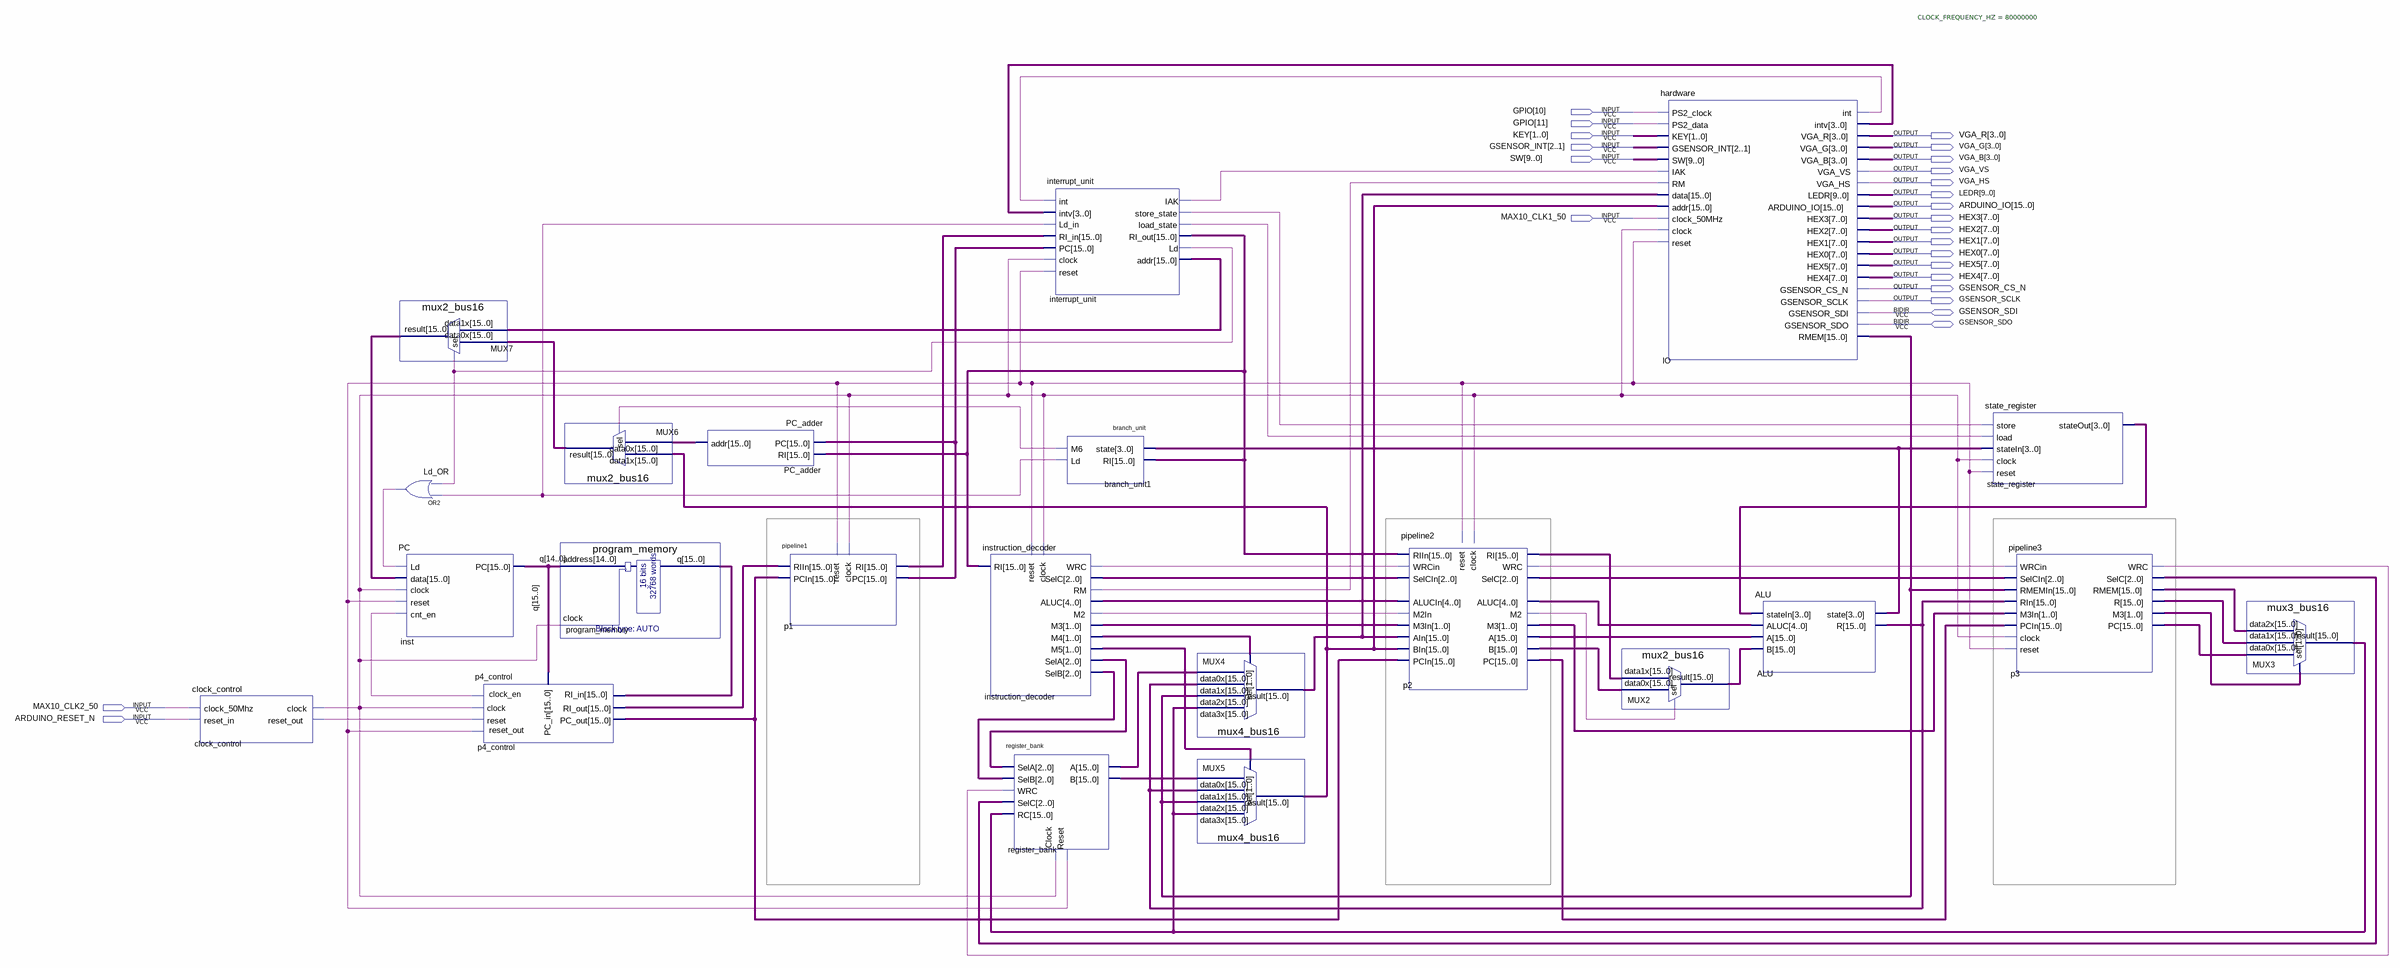
[diagram p0: schematic sheet]
// Quartus schematic P4.bdf as structural Verilog: 22 symbols, 25 pins
module P4 (
  input  [11:10] GPIO,
  input  [1:0] KEY,
  input  [2:1] GSENSOR_INT,
  input  [9:0] SW,
  input  MAX10_CLK1_50,
  input  MAX10_CLK2_50,
  input  ARDUINO_RESET_N,
  inout  GSENSOR_SDI,
  inout  GSENSOR_SDO,
  output [3:0] VGA_R,
  output [3:0] VGA_G,
  output [3:0] VGA_B,
  output VGA_VS,
  output VGA_HS,
  output [9:0] LEDR,
  output [15:0] ARDUINO_IO,
  output [7:0] HEX3,
  output [7:0] HEX2,
  output [7:0] HEX1,
  output [7:0] HEX0,
  output [7:0] HEX5,
  output [7:0] HEX4,
  output GSENSOR_CS_N,
  output GSENSOR_SCLK
);

  wire branch_unit1_ld, branch_unit1_m6, clock_control_clock, clock_control_reset_out,
       instruction_decoder_m2, instruction_decoder_rm, instruction_decoder_wrc, interrupt_unit_iak,
       interrupt_unit_ld, interrupt_unit_load_state, interrupt_unit_store_state, IO_int, Ld_OR_out, p2_m2,
       p2_wrc, p3_wrc, p4_control_clock_en, p4_control_reset_out;
  wire [1:0] instruction_decoder_m3, instruction_decoder_m4, instruction_decoder_m5, p2_m3, p3_m3;
  wire [2:0] instruction_decoder_sela, instruction_decoder_selb, instruction_decoder_selc, p2_selc, p3_selc;
  wire [3:0] ALU_state, IO_intv, state_register_stateout;
  wire [4:0] instruction_decoder_aluc, p2_aluc;
  wire [15:0] ALU_r, interrupt_unit_addr, interrupt_unit_ri_out, IO_rmem, MUX2_result, MUX3_result,
       MUX4_result, MUX5_result, MUX6_result, MUX7_result, p1_pc, p1_ri, p2_a, p2_b, p2_pc, p2_ri, p3_pc,
       p3_r, p3_rmem, p4_control_pc_out, p4_control_ri_out, PC_adder_addr, program_memory_q, q,
       register_bank_a, register_bank_b;

  clock_control clock_control (
    .clock_50Mhz(MAX10_CLK2_50), .reset_in(ARDUINO_RESET_N), .clock(clock_control_clock),
    .reset_out(clock_control_reset_out));
  mux2_bus16 MUX7 (.data1x(interrupt_unit_addr), .data0x(MUX6_result), .sel(interrupt_unit_ld), .result(MUX7_result));
  or Ld_OR (Ld_OR_out, branch_unit1_ld, interrupt_unit_ld);
  PC inst (
    .Ld(Ld_OR_out), .data(MUX7_result), .clock(clock_control_clock), .reset(p4_control_reset_out),
    .cnt_en(p4_control_clock_en), .PC(q));
  p4_control p4_control (
    .PC_in(q), .RI_in(program_memory_q), .clock(clock_control_clock), .reset(clock_control_reset_out),
    .clock_en(p4_control_clock_en), .reset_out(p4_control_reset_out), .PC_out(p4_control_pc_out),
    .RI_out(p4_control_ri_out));
  mux2_bus16 MUX6 (.data1x(MUX5_result), .data0x(PC_adder_addr), .sel(branch_unit1_m6), .result(MUX6_result));
  program_memory program_memory (.address(q[14:0]), .clock(clock_control_clock), .q(program_memory_q));
  PC_adder PC_adder (.PC(p1_pc), .RI(interrupt_unit_ri_out), .addr(PC_adder_addr));
  pipeline1 p1 (
    .RIIn(p4_control_ri_out), .PCIn(p4_control_pc_out), .clock(clock_control_clock),
    .reset(p4_control_reset_out), .RI(p1_ri), .PC(p1_pc));
  instruction_decoder instruction_decoder (
    .RI(interrupt_unit_ri_out), .clock(clock_control_clock), .reset(p4_control_reset_out),
    .WRC(instruction_decoder_wrc), .SelC(instruction_decoder_selc), .RM(instruction_decoder_rm),
    .ALUC(instruction_decoder_aluc), .M2(instruction_decoder_m2), .M3(instruction_decoder_m3),
    .M4(instruction_decoder_m4), .M5(instruction_decoder_m5), .SelA(instruction_decoder_sela),
    .SelB(instruction_decoder_selb));
  register_bank register_bank (
    .SelA(instruction_decoder_sela), .SelB(instruction_decoder_selb), .WRC(p3_wrc), .SelC(p3_selc),
    .RC(MUX3_result), .Reset(p4_control_reset_out), .Clock(clock_control_clock), .A(register_bank_a),
    .B(register_bank_b));
  interrupt_unit interrupt_unit (
    .\int (IO_int), .intv(IO_intv), .Ld_in(branch_unit1_ld), .RI_in(p1_ri), .PC(p1_pc),
    .clock(clock_control_clock), .reset(p4_control_reset_out), .IAK(interrupt_unit_iak),
    .store_state(interrupt_unit_store_state), .load_state(interrupt_unit_load_state),
    .RI_out(interrupt_unit_ri_out), .Ld(interrupt_unit_ld), .addr(interrupt_unit_addr));
  branch_unit branch_unit1 (.state(ALU_state), .RI(interrupt_unit_ri_out), .M6(branch_unit1_m6), .Ld(branch_unit1_ld));
  mux4_bus16 MUX4 (
    .data3x(MUX3_result), .data2x(IO_rmem), .data1x(ALU_r), .data0x(register_bank_a),
    .sel(instruction_decoder_m4), .result(MUX4_result));
  mux4_bus16 MUX5 (
    .data3x(MUX3_result), .data2x(IO_rmem), .data1x(ALU_r), .data0x(register_bank_b),
    .sel(instruction_decoder_m5), .result(MUX5_result));
  pipeline2 p2 (
    .RIIn(interrupt_unit_ri_out), .WRCin(instruction_decoder_wrc), .SelCIn(instruction_decoder_selc),
    .ALUCIn(instruction_decoder_aluc), .M2In(instruction_decoder_m2), .M3In(instruction_decoder_m3),
    .AIn(MUX4_result), .BIn(MUX5_result), .PCIn(p4_control_pc_out), .clock(clock_control_clock),
    .reset(p4_control_reset_out), .RI(p2_ri), .WRC(p2_wrc), .SelC(p2_selc), .ALUC(p2_aluc), .M2(p2_m2),
    .M3(p2_m3), .A(p2_a), .B(p2_b), .PC(p2_pc));
  mux2_bus16 MUX2 (.data1x(p2_ri), .data0x(p2_b), .sel(p2_m2), .result(MUX2_result));
  hardware #(.CLOCK_FREQUENCY_HZ(80000000)) IO (
    .PS2_clock(GPIO[10]), .PS2_data(GPIO[11]), .KEY(KEY), .GSENSOR_INT(GSENSOR_INT), .SW(SW),
    .IAK(interrupt_unit_iak), .RM(instruction_decoder_rm), .data(MUX4_result), .addr(MUX5_result),
    .clock_50MHz(MAX10_CLK1_50), .clock(clock_control_clock), .reset(p4_control_reset_out), .\int (IO_int),
    .intv(IO_intv), .VGA_R(VGA_R), .VGA_G(VGA_G), .VGA_B(VGA_B), .VGA_VS(VGA_VS), .VGA_HS(VGA_HS),
    .LEDR(LEDR), .ARDUINO_IO(ARDUINO_IO), .HEX3(HEX3), .HEX2(HEX2), .HEX1(HEX1), .HEX0(HEX0), .HEX5(HEX5),
    .HEX4(HEX4), .GSENSOR_CS_N(GSENSOR_CS_N), .GSENSOR_SCLK(GSENSOR_SCLK), .RMEM(IO_rmem),
    .GSENSOR_SDI(GSENSOR_SDI), .GSENSOR_SDO(GSENSOR_SDO));
  ALU ALU (.stateIn(state_register_stateout), .ALUC(p2_aluc), .A(p2_a), .B(MUX2_result), .state(ALU_state), .R(ALU_r));
  state_register state_register (
    .store(interrupt_unit_store_state), .load(interrupt_unit_load_state), .stateIn(ALU_state),
    .clock(clock_control_clock), .reset(p4_control_reset_out), .stateOut(state_register_stateout));
  pipeline3 p3 (
    .WRCin(p2_wrc), .SelCIn(p2_selc), .RMEMIn(IO_rmem), .RIn(ALU_r), .M3In(p2_m3), .PCIn(p2_pc),
    .clock(clock_control_clock), .reset(p4_control_reset_out), .WRC(p3_wrc), .SelC(p3_selc), .RMEM(p3_rmem),
    .R(p3_r), .M3(p3_m3), .PC(p3_pc));
  mux3_bus16 MUX3 (.data2x(p3_rmem), .data1x(p3_r), .data0x(p3_pc), .sel(p3_m3), .result(MUX3_result));
endmodule
